# Altium project ELOC_Receiver.PrjPcb
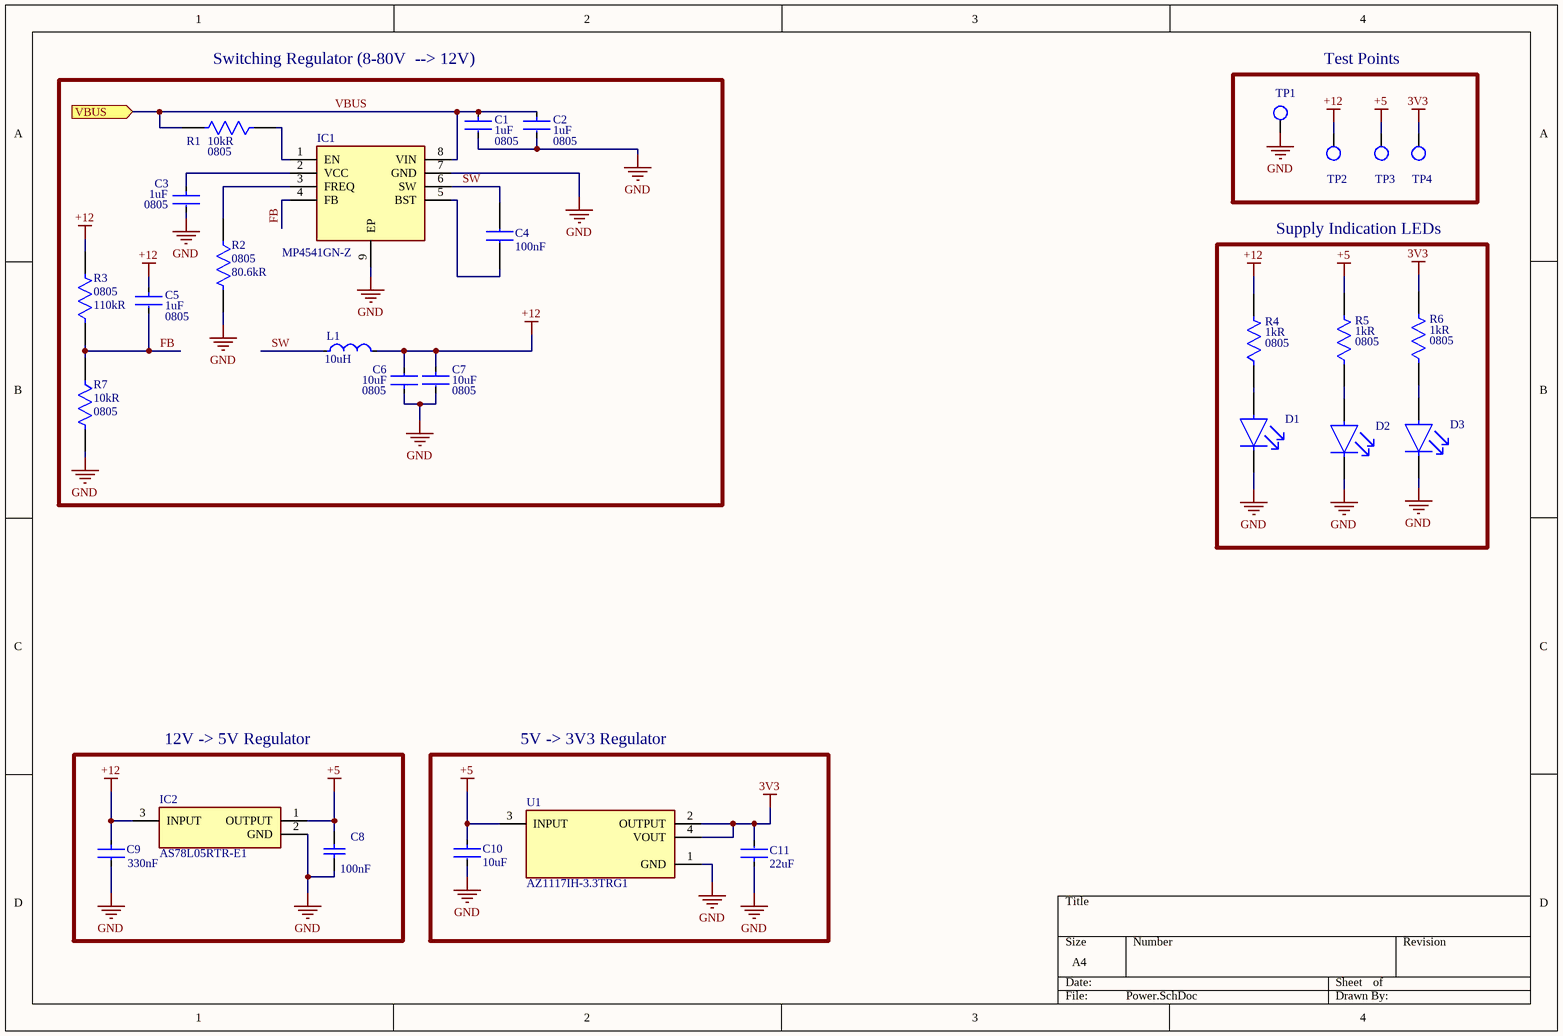
[diagram p0: Power.SchDoc]
3 sheets, 80 parts. Net scope: flat (ports and power ports of the same name join across sheets).
Board file: ELOC_Receiver.PcbDoc
Sheets:
  Power.SchDoc
  Rectifier.SchDoc
  Processor.SchDoc

## Sheet Power.SchDoc
size A4; SheetNumber: 1; SheetTotal: 3

### Parts
C1  Capacitance: 1uF  Case Code (Imperial): 0805  [FP-885012207078-MFG]  (hidden comment: 885012207078)
C2  Capacitance: 1uF  Case Code (Imperial): 0805  [FP-885012207078-MFG]  (hidden comment: 885012207078)
C3  Capacitance: 1uF  Case Code (Imperial): 0805  [FP-885012207078-MFG]  (hidden comment: 885012207078)
C4  Capacitance: 100nF  [C0805]  (hidden comment: C0805C104K1RACAUTO7210)
C5  Capacitance: 1uF  Case Code (Imperial): 0805  [FP-885012207078-MFG]  (hidden comment: 885012207078)
C6  Capacitance: 10uF  Case/Package: 0805  [FP-CL21-IPC_C]  (hidden comment: CL21A106KOQNNNG)
C7  Capacitance: 10uF  Case/Package: 0805  [FP-CL21-IPC_C]  (hidden comment: CL21A106KOQNNNG)
C8  Capacitance: 100nF  [CAPC2013X140X50ML20T25]  (hidden comment: 08055D104KAT2A)
C9  Capacitance: 330nF  [FP-CL21-F-IPC_C]  (hidden comment: CL21B334KBFNNNE)
C10  Capacitance: 10uF  [FP-CL21-IPC_B]  (hidden comment: CL21A106KOQNNNE)
C11  Capacitance: 22uF  [FP-CL21-IPC_B]  (hidden comment: CL21A226MQQNNNG)
D1  12V  [FP-150060VS75000-MFG]  (value not drawn)
D2  5V  [FP-150060VS75000-MFG]  (value not drawn)
D3  3V3  [FP-150060VS75000-MFG]  (value not drawn)
IC1  MP4541GN-Z  [SOIC127P600X170-9N]
IC2  AS78L05RTR-E1  [DIODES_SOT-89]
L1  Inductance: 10uH  [FP-LB2518-1_8-0_2-IPC_A]  (hidden comment: LBR2518T100K)
R1  Resistance: 10kR  Case Code (Imperial): 0805  [FP-RMCF0805-IPC_A]  (hidden comment: RMCF0805JT10K0)
R2  Case/Package: 0805  Resistance: 80.6kR  [FP-CRCW0805-e3-IPC_A]  (hidden comment: CRCW080580K6FKEA)
R3  Size Code: 0805  Resistance: 110kR  [FP-RMCF0805-IPC_C]  (hidden comment: RMCF0805FT110K)
R4  Resistance: 1kR  Size Code: 0805  [FP-RNCP0805-MFG]  (hidden comment: RNCP0805FTD1K00)
R5  Resistance: 1kR  Size Code: 0805  [FP-RNCP0805-MFG]  (hidden comment: RNCP0805FTD1K00)
R6  Resistance: 1kR  Size Code: 0805  [FP-RNCP0805-MFG]  (hidden comment: RNCP0805FTD1K00)
R7  Resistance: 10kR  Case Code (Imperial): 0805  [FP-RMCF0805-IPC_A]  (hidden comment: RMCF0805JT10K0)
TP1  GND  [TESTPOINT_LOOP]  (value not drawn)
TP2  12V  [TESTPOINT_LOOP]  (value not drawn)
TP3  5V  [TESTPOINT_LOOP]  (value not drawn)
TP4  3V3  [TESTPOINT_LOOP]  (value not drawn)
U1  AZ1117IH-3.3TRG1  [FP-SOT223-IPC_B]

### Blocks framed on the sheet
Switching Regulator (8-80V  --> 12V): C1-C7 IC1 L1 R1-R3 R7
Test Points: TP1-TP4
Supply Indication LEDs: D1-D3 R4-R6
12V -> 5V Regulator: C8 C9 IC2
5V -> 3V3 Regulator: C10 C11 U1

### Ports
VBUS (in)

### Nets
3V3: C11.2 R6.2 TP4.1 U1.2(OUTPUT) U1.4(VOUT)
+5: C8.2 C10.1 IC2.1(OUTPUT) R5.2 TP3.1 U1.3(INPUT)
+12: C5.1 C6.2 C7.1 C9.1 IC2.3(INPUT) L1.2 R3.2 R4.2 TP2.1
GND: C1.2 C2.2 C3.2 C6.1 C7.2 C8.1 C9.2 C10.2 C11.1 D1.1(C) D2.1(C) D3.1(C) IC1.7(GND) IC1.9(EP) IC2.2(GND) R2.2 R7.2 TP1.1 U1.1(GND)
FB: C5.2 IC1.4(FB) R3.1 R7.1
SW: C4.2 IC1.6(SW) L1.1
VBUS: C1.1 C2.1 IC1.8(VIN) R1.2 ; port VBUS
NetC3_1: C3.1 IC1.2(VCC)
NetC4_1: C4.1 IC1.5(BST)
NetD1_2: D1.2(A) R4.1
NetD2_2: D2.2(A) R5.1
NetD3_2: D3.2(A) R6.1
NetIC1_1: IC1.1(EN) R1.1
NetIC1_3: IC1.3(FREQ) R2.1

### Library data of the parts
C1-C3 C5 = CMP-207839-000010-1: CAP CER 1UF 25V X7R 0805; Tolerance: 10%; Series: WCAP-CSGP; Mount: Surface Mount; RoHS Compliant: Yes; Case Code (Metric): 2012; Width: 0.049inch; Thickness: 0.053inch; Dielectric: X7R; Max Operating Temperature: 125°C; Case/Package: 0805; Length: 0.079inch; Voltage Rating: 25V; Packaging: Cut Tape; Min Operating Temperature: -55°C; Voltage Rating (DC): 25V
C4 = C0805C104K1RACAUTO7210: Capacitor; Manufacturer_Name: KEMET; Datasheet Link: https://content.kemet.com/datasheets/KEM_C1023_X7R_AUTO_SMD.pdf; Height: 1.1mm; Manufacturer_Part_Number: C0805C104K1RACAUTO7210; Mouser Part Number: 80-C0805C104K1RAUTLR; Mouser Price/Stock: https://www.mouser.co.uk/ProductDetail/KEMET/C0805C104K1RACAUTO7210?qs=NJR6qtu0rR34GE7CYHVK6Q%3D%3D; Arrow Part Number: C0805C104K1RACAUTO7210; Arrow Price/Stock: https://www.arrow.com/en/products/c0805c104k1racauto7210/kemet-corporation?region=europe
C6 C7 = CMP-13271-002240-1: CL21 Series 0805 10uF 16V ±10% Tolerance X5R Multilayer Ceramic Chip Capacitor; Case Code (Metric): 2012; Package Quantity: 3000; Width: 0.049inch; Mount: Surface Mount; Depth: 1.25mm; Material: Ceramic; Min Operating Temperature: -55°C; Thickness: 0.053inch; Tolerance: 10%; Case Code (Imperial): 0805; Packaging: Tape and Reel; Voltage Rating: 16V; Height: 1.25mm; Voltage: 16V; Max Operating Temperature: 85°C; Length: 2mm; Dielectric: X5R
C8 = CMP-2007-04689-1: Manufacturer: AVX Interconnect / Elco; Part Number: 08055D104KAT2A
C9 = CMP-13271-000003-1: CAP CER 0.33UF 50V X7R 0805; Manufacturer: Samsung Electro-Mechanics; Temperature Coefficient: 15%; Value: 330nF; Material: Ceramic; Tolerance: 10%; Category: Cap; Temperature Range Low: -55°C; Height: 1.35mm; Ipc Land Pattern Name: CAPC200125X125; ComponentLink2URL: http://www.samsungsem.com/kr/support/product-search/mlcc/__icsFiles/afieldfile/2018/07/24/CL21B334KBFNNNE.pdf; Octopart: https://octopart.com/cl21b334kbfnnne-samsung-9287149; Digikey Description: CAP CER 0.33UF 50V X7R 0805; Automotive: No; ComponentLink2Description: Datasheet; Lead Free: Yes; Voltage Rating: 50V; Device Class L2: Capacitors; Device Class L1: Passive Components; RoHS: TRUE; Manufacturer Part Number: CL21B334KBFNNNE; Temperature: -55°C to +125°C; Package: CL21-F; Temperature Range High: +125°C; Temperature Characteristic: X7R; Device Class L3: Ceramic Capacitors
C10 = CMP-2000-06102-2: CL21 Series 0805 10uF 16V ±10% Tolerance X5R Multilayer Ceramic Chip Capacitor; Dielectric: X7R; Length: 2mm; Depth: 1.25mm; Voltage: 16V; Width: 0.049inch; Lead Free: Lead Free; Max Operating Temperature: 85°C; Mount: Surface Mount; Voltage Rating: 16V; Height: 1.25mm; Radiation Hardening: No; Packaging: Tape and Reel; Voltage Rating (DC): 16V; Thickness: 0.055inch; Case/Package: 0805; Case Code (Imperial): 0805; Min Operating Temperature: -55°C; Case Code (Metric): 2012; Package Quantity: 1; Tolerance: 10%
C11 = CMP-13271-002967-1: CL21 Series 0805 22uF 6.3V ±20% Tolerance X5R Multilayer Ceramic Chip Capacitor; Tolerance: 20%; Case Code (Imperial): 0805; Package Quantity: 3000; Min Operating Temperature: -55°C; Case Code (Metric): 2012; Length: 2mm; Material: Ceramic; Max Operating Temperature: 85°C; Radiation Hardening: No; Packaging: Tape and Reel; Depth: 1.25mm; Mount: Surface Mount; Dielectric: X5R; Case/Package: 0805; Height: 1.25mm; Thickness: 0.055inch; Voltage: 6.3V; Width: 0.049inch; Voltage Rating: 6.3V
D1 D3 = CMP-1426-00006-5: LED GREEN CLEAR 0603 SMD; Viewing Angle: 140°; Reverse Voltage (DC): 5V; Forward Voltage: 2V; Power Rating: 72mW; Lens Size: 0.7mm; Test Current: 20mA; Lens Color: Colorless; Lens Style: Rectangular; Luminous Intensity: 40mcd; Wavelength: 570nm; Length: 1.6mm; Max Operating Temperature: 85°C; Lens Transparency: Clear; Width: 0.8mm; Mount: Surface Mount; Weight: 0.000882oz; Package Quantity: 4000; Packaging: Cut Tape; RoHS Compliant: Yes; Case/Package: 0603; Series: WL-SMCW; Case Code (Metric): 1608; Illumination Color: Green; Color: Green; Case Code (Imperial): 0603; Forward Current: 20mA; Min Operating Temperature: -40°C; Height: 0.8mm; Dominant Wavelength: 570nm; Number of Pins: 2
D2 = CMP-1426-00006-5: LED GREEN CLEAR 0603 SMD; Viewing Angle: 140°; Forward Voltage: 2V; Power Rating: 72mW; Lens Size: 0.7mm; Test Current: 20mA; Lens Color: Colorless; Lens Style: Rectangular; Luminous Intensity: 40mcd; Wavelength: 570nm; Length: 1.6mm; Max Operating Temperature: 85°C; Reverse Voltage (DC): 5V; Lens Transparency: Clear; Width: 0.8mm; Mount: Surface Mount; Weight: 0.000882oz; Package Quantity: 4000; Packaging: Cut Tape; RoHS Compliant: Yes; Case/Package: 0603; Series: WL-SMCW; Case Code (Metric): 1608; Illumination Color: Green; Color: Green; Case Code (Imperial): 0603; Forward Current: 20mA; Min Operating Temperature: -40°C; Height: 0.8mm; Dominant Wavelength: 570nm; Number of Pins: 2
IC1 = MP4541GN-Z: Integrated Circuit; Manufacturer_Name: Monolithic Power Systems (MPS); Datasheet Link: https://www.monolithicpower.com/en/documentview/productdocument/index/version/2/document_type/Datasheet/lang/en/sku/MP4541GN/; Height: 1.7mm; Manufacturer_Part_Number: MP4541GN-Z; Mouser Part Number: 946-MP4541GN-Z; Mouser Price/Stock: https://www.mouser.co.uk/ProductDetail/Monolithic-Power-Systems-MPS/MP4541GN-Z?qs=TCDPyi3sCW3JrMFxnpK4AA%3D%3D
IC2 = AS78L05RTR-E1: Integrated Circuit; Manufacturer_Name: Diodes Inc.; Datasheet Link: https://www.diodes.com/assets/Datasheets/AS78Lxx.pdf; Manufacturer_Part_Number: AS78L05RTR-E1; Mouser Part Number: 621-AS78L05RTR-E1; Mouser Price/Stock: https://www.mouser.co.uk/ProductDetail/Diodes-Incorporated/AS78L05RTR-E1?qs=FKu9oBikfSksfBIasZ7FtQ%3D%3D; Arrow Part Number: AS78L05RTR-E1; Arrow Price/Stock: https://www.arrow.com/en/products/as78l05rtr-e1/diodes-incorporated?region=asia
L1 = CMP-14484-000483-1: SMD Inductors 10uH ±10% 0.235A 0.247Ω 1007; Test Frequency: 2.52MHz; Core Material: Ferrite; Max DC Current: 235mA; Shielding: Unshielded; DC Resistance (DCR): 190mR; Self Resonant Frequency: 30MHz; Package Quantity: 2000; Height - Seated (Max): 0.079inch; Lead Free: Lead Free; Radiation Hardening: No; Case Code (Metric): 2518; Mount: Surface Mount; Current Rating: 235mA; Width: 0.071inch; Military Standard: Not; Tolerance: 10%; Series: LB; Case/Package: 1007; Termination: SMD/SMT; DC Current: 235mA; Height: 1.8mm; Inductance Tolerance: 10%; Max Operating Temperature: 105°C; Packaging: Tape and Reel; Case Code (Imperial): 1007; Min Operating Temperature: -40°C; Depth: 2mm; Resistor Type: Wirewound; RoHS Compliant: Yes; Halogen Free: Halogen Free; Length: 0.098inch; Lead Pitch: 1.5mm
R1 R7 = CMP-26527-002663-1: 10kΩ ±5% 0.125W 0805 Thick Film Chip Resistor AEC-Q200 compliant; Max Power Dissipation: 125mW; Temperature Coefficient: 100ppm/°C; Construction: Rectangular; RoHS Compliant: Yes; Resistor Type: Thick Film; Series: RMCF; Features: Automotive AEC-Q200; Mount: Surface Mount; Min Operating Temperature: -55°C; Military Standard: Not; Tolerance: 5%; Size Code: 0805; Contact Plating: Tin; Length: 2mm; Depth: 1.25mm; Case Code (Metric): 2012; Packaging: Tape and Reel; Radiation Hardening: No; Height: 0.026inch; Case/Package: 0805; Width: 0.049inch; Lead Free: Lead Free; Max Operating Temperature: 155°C; Number of Terminations: 2; Power Rating: 125mW
R2 = CMP-2001-04127-2: RES Thick Film, 80.6kΩ, 1%, 0.125W, 100ppm/°C, 0805; Power Rating: 125mW; Voltage Rating: 150V; Tolerance: 1%; Min Operating Temperature: -55°C; Number of Pins: 2; Max Power Dissipation: 125mW; Radiation Hardening: No; Max Operating Temperature: 155°C; Composition: Thick Film; Temperature Coefficient: 100ppm/°C; Width: 1.25mm; Length: 2mm; Case Code (Metric): 2012; Packaging: Tape and Reel; Contact Plating: Tin; Termination: Solder; Features: Automotive AEC-Q200; Number of Terminations: 2; Military Standard: Not; Weight: 0.000194oz; Case Code (Imperial): 0805; Depth: 1.25mm; Lead Free: Lead Free; Package Quantity: 10; Height: 0.45mm; Voltage Rating (DC): 150V
R3 = CMP-26527-000712-1: 110kΩ ±1% 0.125W 0805 Thick Film Chip Resistor AEC-Q200 compliant; Power Rating: 125mW; Temperature Coefficient: 100ppm/°C; Features: Automotive AEC-Q200; Radiation Hardening: No; Width: 0.049inch; RoHS Compliant: Yes; Length: 0.079inch; Max Power Dissipation: 125mW; Case Code (Imperial): 0805; Mount: Surface Mount; Series: RMCF; Max Operating Temperature: 155°C; Lead Free: Lead Free; Case Code (Metric): 2012; Height: 0.026inch; Case/Package: 0805; Number of Terminations: 2; Resistor Type: Thick Film; Packaging: Tape and Reel; Tolerance: 1%; Contact Plating: Tin; Min Operating Temperature: -55°C
R4-R6 = CMP-26527-001902-1: 1kΩ ±1% 0.25W 0805 High Power Anti-Sulfur Thin Film Chip Resistor; Power Rating: 250mW; Temperature Coefficient: 100ppm/°C; Series: RNCP; RoHS Compliant: Yes; Case Code (Metric): 2012; Length: 0.079inch; Case/Package: 0805; Max Power Dissipation: 250mW; Height: 0.024inch; Max Operating Temperature: 155°C; Tolerance: 1%; Min Operating Temperature: -55°C; Width: 0.049inch; Case Code (Imperial): 0805; Packaging: Tape and Reel; Mount: Surface Mount; Features: Moisture Resistant; Lead Free: Lead Free; Resistor Type: Thin Film; Number of Terminations: 2
TP1-TP4 = TESTPOINT_LOOP: PC TEST POINT MINIATURE WHITE; Manufacturer 1: Keystone Electronics; Manufacturer Part Number 1: 5002; Supplier Part Number 1: 36-5002-ND; Supplier 1: Digi-Key; Mount: Through Hole
U1 = CMP-12756-000043-1: IC REG LINEAR 3.3V 1A SOT223; Output Current: 800mA; Number of Regulators: 1; Dropout Voltage: 1.2V; RoHS Compliant: Yes; Min Current Limit: 1A; Mount: Surface Mount; Packaging: Tape and Reel; Output Voltage: 3.3V; Min Operating Temperature: -40°C; Max Operating Temperature: 125°C; Number of Pins: 3; Case/Package: TO-261-4

## Sheet Rectifier.SchDoc
size A4; SheetNumber: 2; SheetTotal: 3
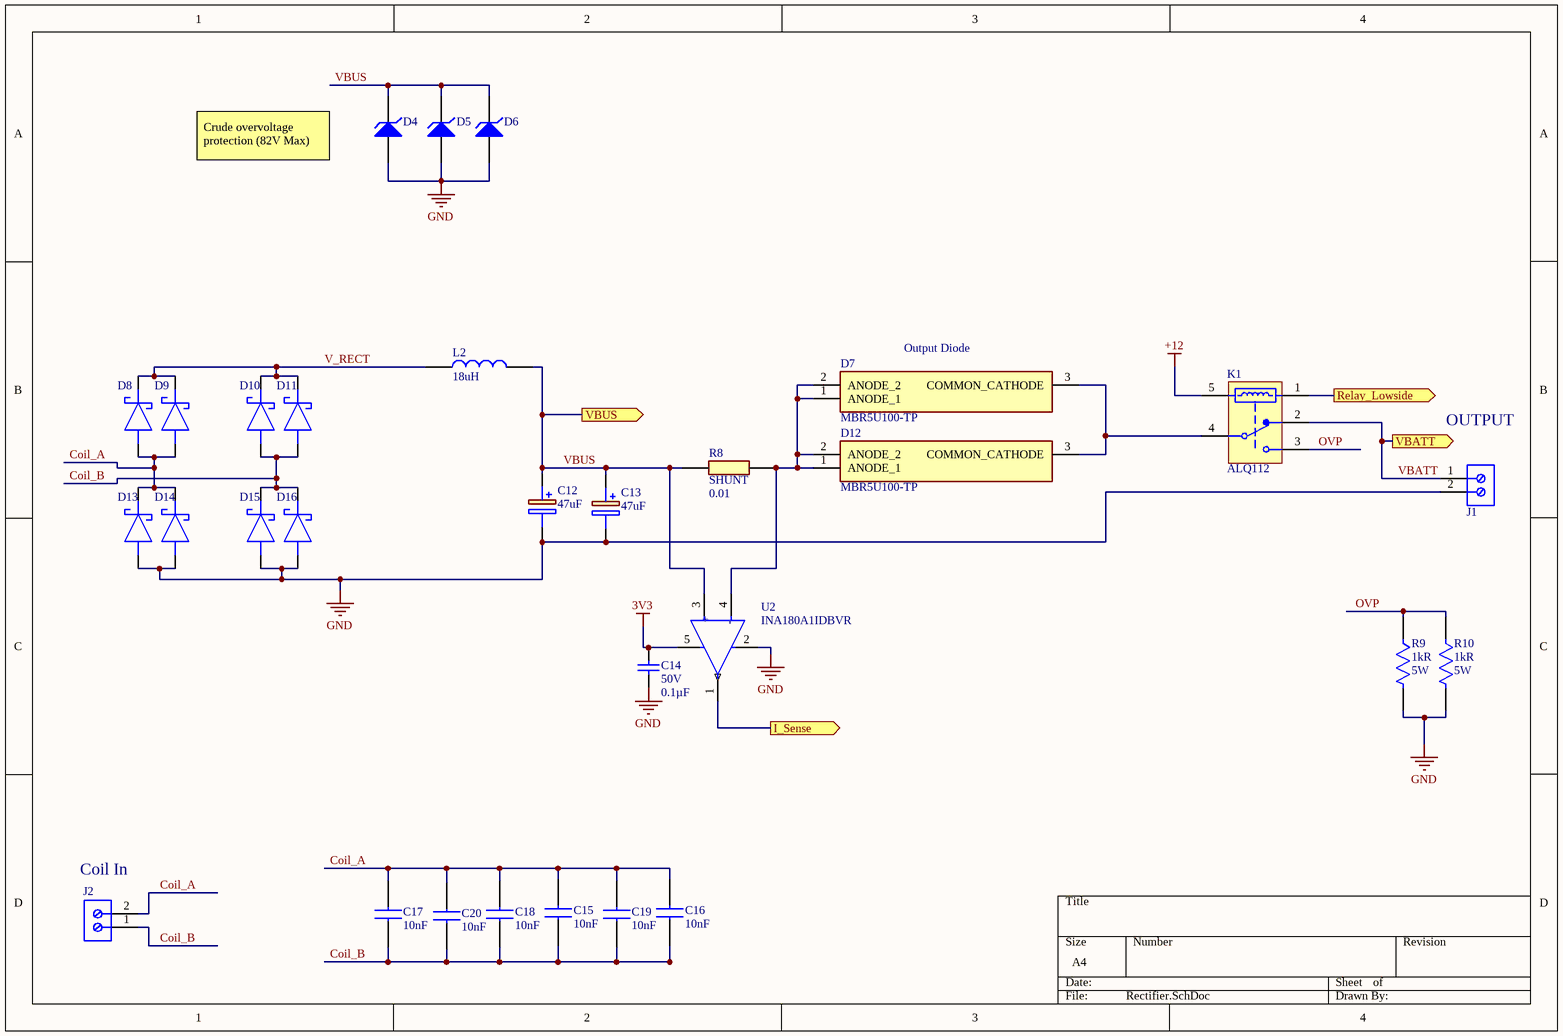
[diagram p1: Rectifier.SchDoc]

### Parts
C12  Capacitance: 47uF  [CAPAE1030X1080N]  (hidden comment: UCD1K470MNL1GS)
C13  Capacitance: 47uF  [CAPAE1030X1080N]  (hidden comment: UCD1K470MNL1GS)
C14  Voltage - Rated: 50V  Capacitance: 0.1µF  [CAP0805]  (hidden comment: C0805C104K5RACTU)
C15  Capacitance: 10nF  [CAPC3216X110N]  (hidden comment: C1206C103JAGECAUTO)
C16  Capacitance: 10nF  [CAPC3216X110N]  (hidden comment: C1206C103JAGECAUTO)
C17  Capacitance: 10nF  [CAPC3216X110N]  (hidden comment: C1206C103JAGECAUTO)
C18  Capacitance: 10nF  [CAPC3216X110N]  (hidden comment: C1206C103JAGECAUTO)
C19  Capacitance: 10nF  [CAPC3216X110N]  (hidden comment: C1206C103JAGECAUTO)
C20  Capacitance: 10nF  [CAPC3216X110N]  (hidden comment: C1206C103JAGECAUTO)
D4  1SMB5947BT3G  [ONSC-SMB-2-403A-03_H_V]  (value not drawn)
D5  1SMB5947BT3G  [ONSC-SMB-2-403A-03_H_V]  (value not drawn)
D6  1SMB5947BT3G  [ONSC-SMB-2-403A-03_H_V]  (value not drawn)
D7  MBR5U100-TP  [MBR5U100TP]
D8  STPS4S200UFN  [SODFL5436X110N]  (value not drawn)
D9  STPS4S200UFN  [SODFL5436X110N]  (value not drawn)
D10  STPS4S200UFN  [SODFL5436X110N]  (value not drawn)
D11  STPS4S200UFN  [SODFL5436X110N]  (value not drawn)
D12  MBR5U100-TP  [MBR5U100TP]
D13  STPS4S200UFN  [SODFL5436X110N]  (value not drawn)
D14  STPS4S200UFN  [SODFL5436X110N]  (value not drawn)
D15  STPS4S200UFN  [SODFL5436X110N]  (value not drawn)
D16  STPS4S200UFN  [SODFL5436X110N]  (value not drawn)
J1  691137710002  [691137710002]  (value not drawn)
J2  691137710002  [691137710002]  (value not drawn)
K1  ALQ112  [PNSC-LQ-5-2000x1000x1600_V]
L2  Inductance: 18uH  [SDR1307-220ML]  (hidden comment: SDR1307-180ML)
R8  SHUNT  Resistance: 0.01  [RESC6434X90N]
R9  Resistance: 1kR  Max Power Dissipation: 5W  [FP-SMF5-MFG]  (hidden comment: SMF51K0JT)
R10  Resistance: 1kR  Max Power Dissipation: 5W  [FP-SMF5-MFG]  (hidden comment: SMF51K0JT)
U2  INA180A1IDBVR  [FP-DBV0005A-IPC_A]

### Ports
I_Sense (out), Relay_Lowside (out), VBATT (out), VBUS (out)

### Nets
3V3: C14.2 U2.5(VS)
+12: K1.5
GND: C12.2(-) C13.2(-) C14.1 D4.2(A) D5.2(A) D6.2(A) D13.2(A) D14.2(A) D15.2(A) D16.2(A) J1.2 R9.2 R10.2 U2.2(GND)
Coil_A: C15.1 C16.1 C17.1 C18.1 C19.1 C20.1 D8.2(A) D9.2(A) D13.1(K) D14.1(K) J2.2
Coil_B: C15.2 C16.2 C17.2 C18.2 C19.2 C20.2 D10.2(A) D11.2(A) D15.1(K) D16.1(K) J2.1
OVP: K1.3(NO) R9.1 R10.1
V_RECT: D8.1(K) D9.1(K) D10.1(K) D11.1(K) L2.1
VBATT: J1.1 K1.2(NC) ; port VBATT
VBUS: C12.1(+) C13.1(+) D4.1(K) D5.1(K) D6.1(K) L2.2 R8.1 U2.3(IN+) ; port VBUS
NetD7_1: D7.1(ANODE_1) D7.2(ANODE_2) D12.1(ANODE_1) D12.2(ANODE_2) R8.2 U2.4(IN-)
NetD7_3: D7.3(COMMON_CATHODE) D12.3(COMMON_CATHODE) K1.4(COM)
NetK1_1: K1.1 ; port Relay_Lowside
NetU2_1: U2.1(OUT) ; port I_Sense

### Notes on the sheet
- Crude overvoltage protection (82V Max)
- (near D7) Output Diode
- (near J1) OUTPUT
- (near J2) Coil In
- (in symbol CMP-04895-000140-1) +; -

### Library data of the parts
C12 C13 = UCD1K470MNL1GS: Capacitor Polarised; Manufacturer_Name: Nichicon; Datasheet Link: https://www.arrow.com/en/products/ucd1k470mnl1gs/nichicon; Height: 10.8mm; Manufacturer_Part_Number: UCD1K470MNL1GS; Mouser Part Number: 647-UCD1K470MNL1GS; Mouser Price/Stock: https://www.mouser.co.uk/ProductDetail/Nichicon/UCD1K470MNL1GS?qs=c0uEScvPYN07T8BStUenxw%3D%3D; Arrow Part Number: UCD1K470MNL1GS; Arrow Price/Stock: https://www.arrow.com/en/products/ucd1k470mnl1gs/nichicon
C14 = C0805C104K5RACTU: CAP CER 0.1UF 50V X7R 0805; Tolerance: ±10%; Supplier 1: Digi-Key; Supplier Part Number 1: 399-1170-1-ND; Temperature Coefficient: X7R; Package / Case: 0805
C15-C20 = C1206C103JAGECAUTO: Capacitor; Manufacturer_Name: KEMET; Datasheet Link: https://content.kemet.com/datasheets/KEM_C1091_C0G_ESD.pdf; Height: 1.1mm; Manufacturer_Part_Number: C1206C103JAGECAUTO; Mouser Part Number: 80-C1206C103JAGECAUT; Mouser Price/Stock: https://www.mouser.co.uk/ProductDetail/KEMET/C1206C103JAGECAUTO?qs=MLItCLRbWsxJM3Q8yxQv7A%3D%3D; Arrow Part Number: C1206C103JAGECAUTO; Arrow Price/Stock: https://www.arrow.com/en/products/c1206c103jagecauto/kemet-corporation?region=nac
D4-D6 = CMP-1060-00168-1: 3 W Zener Voltage Regulator, 2-Pin SMB, Pb-Free, Tape and Reel; Manufacturer: On Semiconductor; VZ Typ (V): 82; Mounting Technology: Surface Mount; ComponentLink1URL: http://www.onsemi.com/; ComponentLink2Description: Datasheet; PackageDescription: 2-Pin Small Molded Package, J-Bend Lead, Body 4.33 x 3.625 mm; ComponentLink3URL: http://www.onsemi.com/pub_link/Collateral/1SMB5913BT3-D.PDF; DatasheetVersion: Rev. 8; ComponentLink2URL: http://www.onsemi.com/pub_link/Collateral/1SMB5913BT3-D.PDF; PackageReference: SMB-2-403A-03_H; PartNumber: 1SMB5947BT3G; RoHS: Pb-Free; PackageVersion: Rev. H, 05/2011; ComponentLink3Description: Package Specification; ComponentLink1Description: Manufacturer URL; Packing: Tape and Reel
D7 D12 = MBR5U100-TP: Schottky Diode; Manufacturer_Name: Micro Commercial Components (MCC); Datasheet Link: https://www.mccsemi.com/pdf/Products/MBR5U100(TO-277).pdf; Height: 1.2mm; Manufacturer_Part_Number: MBR5U100-TP
D8-D11 D13-D16 = STPS4S200UFN: Schottky Diode; Manufacturer_Name: STMicroelectronics; Datasheet Link: https://www.st.com/resource/en/datasheet/stps4s200.pdf; Height: 1.1mm; Manufacturer_Part_Number: STPS4S200UFN; Mouser Part Number: 511-STPS4S200UFN; Mouser Price/Stock: https://www.mouser.co.uk/ProductDetail/STMicroelectronics/STPS4S200UFN?qs=xZ%2FP%252Ba9zWqZ%2F%2FCgto3MYYA%3D%3D; Arrow Part Number: STPS4S200UFN; Arrow Price/Stock: https://www.arrow.com/en/products/stps4s200ufn/stmicroelectronics?region=europe
J1 J2 = CMP-1502-03324-1: Series 1377 - 5.00 mm Horizontal Entry with Pressure Clamp WR-TBL, 2 pin; Manufacturer: Wurth Elektronik; Pin Number: 2; Pitch: 5.00mm; Operating Temperature: -30to120degC; Package Reference: 691137710002; Publisher: WurthElektronik; Mounting Technology: THT; Manufacturer URL: http://www.we-online.de; Packaging: Box; Part Number: 691137710002; Datasheet URL: http://katalog.we-online.de/pbs/datasheet/691137710002.pdf
K1 = CMP-1503-00193-1: LQ Relays, 12 V Coil Voltage, 400 mW Nominal Operating Power, -40 to 85 degC, 5-Pin LQ, Carton, Case, RoHS; Manufacturer: Panasonic; Pb-Free: True; Max Switching Current: 10 A (N.O.), 3 A (N.C.); Electrical Life: 5x10^4; Coil Voltage: 12 V; Max Switching Voltage: 250 V AC; Nominal Operating Power: 400 mW; Mechanical Life(Min.operation): 1x10^7; Packing: Carton, Case; ComponentLink3URL: http://www3.panasonic.biz/ac/e_download/control/relay/power/catalog/mech_eng_lq.pdf?f_cd=401220; ComponentLink1URL: http://www3.panasonic.biz/ac/ae/index.jsp; ComponentLink1Description: Manufacturer URL; Series: LQ Relays; RoHS: True; PackageReference: LQ-5-2000x1000x1600; DatasheetVersion: 201410-T; ComponentLink2Description: Datasheet; ComponentLink2URL: http://www3.panasonic.biz/ac/e_download/control/relay/power/catalog/mech_eng_lq.pdf?f_cd=401220; PackageDescription: 5-Pin Through Hole Terminal Package, Body 20 x 10 mm; PackageVersion: ASCTB92E, 10/2014; PartNumber: ALQ112; ComponentLink3Description: Package Specification; Mounting Technology: Through Hole
L2 = SDR1307-180ML: Inductor; Manufacturer_Name: Bourns; Datasheet Link: https://www.bourns.com/docs/Product-Datasheets/SDR1307.pdf; Manufacturer_Part_Number: SDR1307-180ML; Mouser Part Number: 652-SDR1307-180ML; Mouser Price/Stock: https://www.mouser.co.uk/ProductDetail/Bourns/SDR1307-180ML?qs=meVWcSOgEr47xBfFHZvpmA%3D%3D; Arrow Part Number: SDR1307-180ML; Arrow Price/Stock: https://www.arrow.com/en/products/sdr1307-180ml/bourns?region=nac
R8 = CRA2512-FZ-R010ELF: Resistor; Manufacturer_Name: Bourns; Datasheet Link: http://www.bourns.com/PDFs/CRA.pdf; Height: 0.9mm; Manufacturer_Part_Number: CRA2512-FZ-R010ELF; Mouser Part Number: 652-CRA2512FZR010ELF; Mouser Price/Stock: https://www.mouser.co.uk/ProductDetail/Bourns/CRA2512-FZ-R010ELF?qs=WqWCsLCZBkoNPiv%2FXVnYvw%3D%3D; Arrow Part Number: CRA2512-FZ-R010ELF; Arrow Price/Stock: https://www.arrow.com/en/products/cra2512-fz-r010elf/bourns
R9 R10 = CMP-03211-011405-1: RES SMD 1K OHM 5% 5W 5329; Voltage Rating: 500V; Number of Resistors: 1; Temperature Coefficient: 100ppm/°C; Number of Terminations: 2; Depth: 7.3mm; Packaging: Tape and Reel; Case/Package: SMD/SMT; Tolerance: 5%; RoHS Compliant: Yes; Resistor Type: Power resistor; Features: Flame Retardant Coating; Max Operating Temperature: 280°C; Min Operating Temperature: -80°C; Mount: Surface Mount; Series: SM; Resistance Tolerance: 5%; Height: 6.8mm; Width: 7.3mm; Technology: METAL FILM; Power Rating: 5W; Case Code (Imperial): 5328; ELV: Compliant; Radiation Hardening: No; Voltage Rating (DC): 500V; Length: 13.5mm; Termination: Solder
U2 = CMP-04895-000140-1: IC CURR SENSE 1 CIRCUIT SOT23-5; Input Bias Current: 100nA; Input Offset Voltage (Vos): 100uV; Number of Circuits: 1; Slew Rate: 2V/µs; -3db Bandwidth: 350kHz; Operating Supply Current: 260uA; Case/Package: SOT-23-5; Min Operating Temperature: -40°C; Mount: Surface Mount; Packaging: Tape and Reel; Max Operating Temperature: 125°C

## Sheet Processor.SchDoc
size A4; SheetNumber: 3; SheetTotal: 3
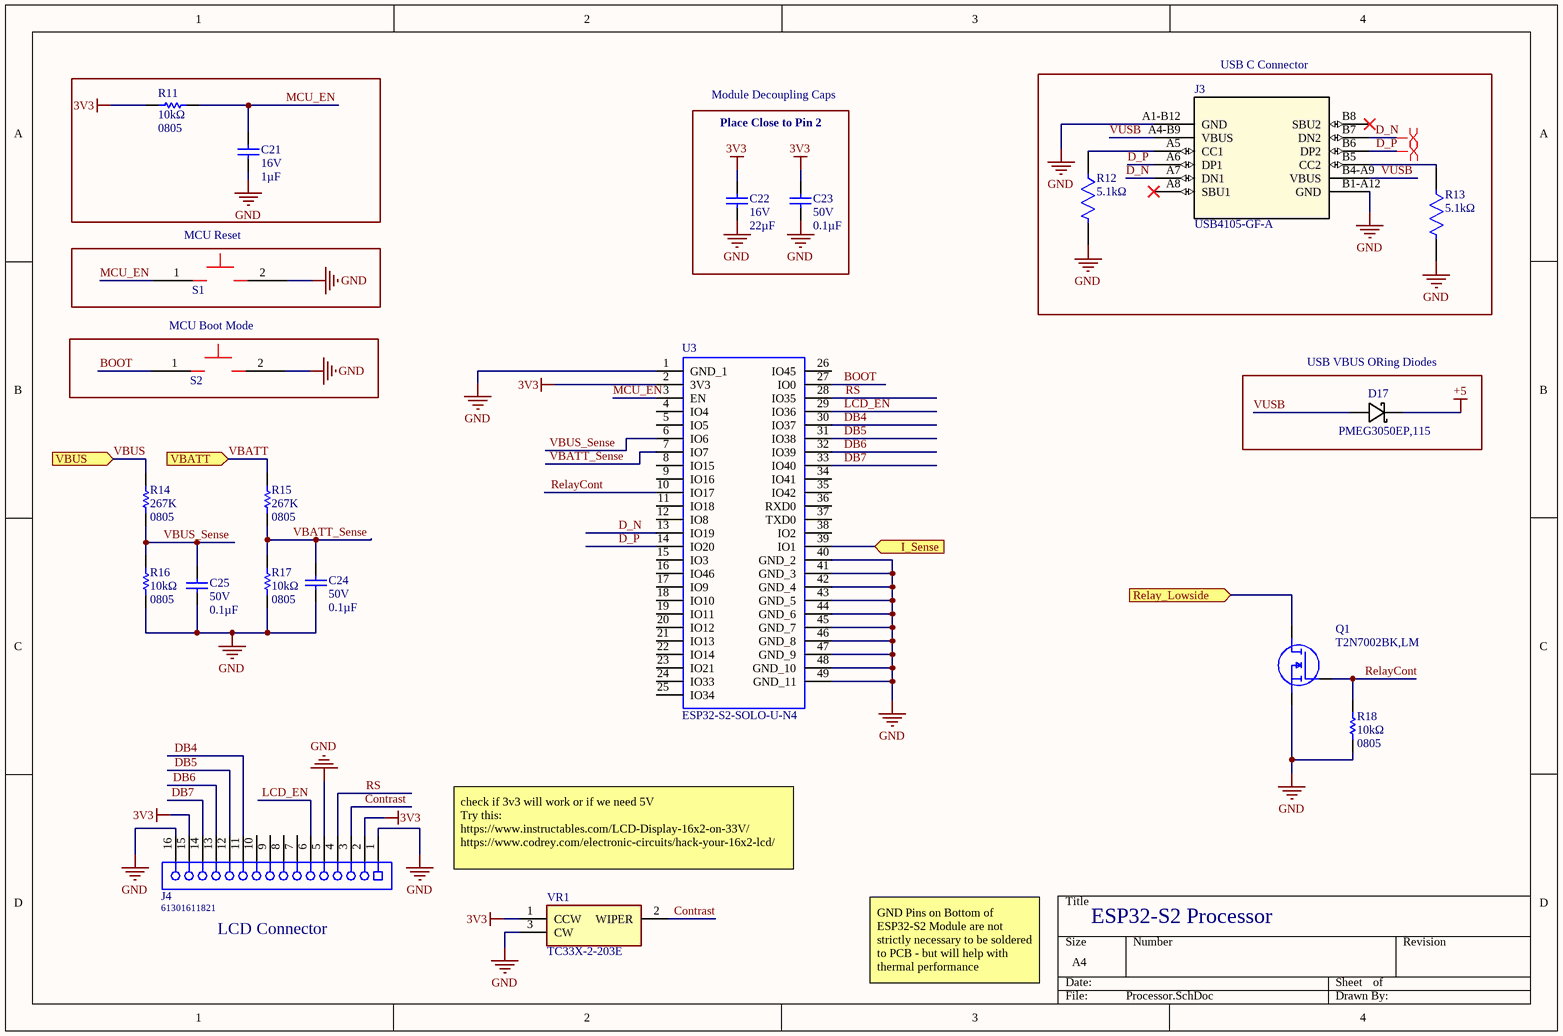
[diagram p2: Processor.SchDoc]

### Parts
C21  Voltage - Rated: 16V  Capacitance: 1µF  [CAP0805]  (hidden comment: GRM21BR71C105KA01L)
C22  Voltage - Rated: 16V  Capacitance: 22µF  [CAP0805]  (hidden comment: CL21A226MOCLRNC)
C23  Voltage - Rated: 50V  Capacitance: 0.1µF  [CAP0805]  (hidden comment: C0805C104K5RACTU)
C24  Voltage - Rated: 50V  Capacitance: 0.1µF  [CAP0805]  (hidden comment: C0805C104K5RACTU)
C25  Voltage - Rated: 50V  Capacitance: 0.1µF  [CAP0805]  (hidden comment: C0805C104K5RACTU)
D17  MFG_PN: PMEG3050EP,115  [SOD-128]  (hidden comment: D_PMEG3050EP,115)
J3  USB4105-GF-A  [USB4105_GCT]
J4  61301611821  [61301611821]
Q1  T2N7002BK,LM  [TBAT54CLM]
R11  Resistance: 10kΩ  Package / Case: 0805  [RES0805]  (hidden comment: RC0805FR-0710KL)
R12  Resistance: 5.1kΩ  [FP-CRCW0805-e3-MFG]  (hidden comment: CRCW08055K10FKEA)
R13  Resistance: 5.1kΩ  [FP-CRCW0805-e3-MFG]  (hidden comment: CRCW08055K10FKEA)
R14  Resistance: 267K  Package: 0805  [RESC2013X60X35NL10T20]  (hidden comment: RC0805FR-07267KL)
R15  Resistance: 267K  Package: 0805  [RESC2013X60X35NL10T20]  (hidden comment: RC0805FR-07267KL)
R16  Resistance: 10kΩ  Package / Case: 0805  [RES0805]  (hidden comment: RC0805FR-0710KL)
R17  Resistance: 10kΩ  Package / Case: 0805  [RES0805]  (hidden comment: RC0805FR-0710KL)
R18  Resistance: 10kΩ  Package / Case: 0805  [RES0805]  (hidden comment: RC0805FR-0710KL)
S1  RESET  [Tactile_Button_3X6X2]  (value not drawn)
S2  BOOT  [Tactile_Button_3X6X2]  (value not drawn)
U3  ESP32-S2-SOLO-U-N4  [ESP32S2SOLOUN4]
VR1  TC33X-2-203E  [TC33X2503E]

### Blocks framed on the sheet
USB C Connector: J3 R12 R13
MCU Reset: S1
MCU Boot Mode: S2
USB VBUS ORing Diodes: D17

### Ports
I_Sense (in), Relay_Lowside (in), VBATT (in), VBUS (in)

### Nets
3V3: C22.2 C23.2 J4.2 J4.15 R11.2 U3.2(3V3) VR1.1(CCW)
+5: D17.2
GND: C21.1 C22.1 C23.1 C24.1 C25.1 J3.A1-B12(GND) J3.B1-A12(GND) J4.1 J4.5 J4.16 Q1.2(S) R12.2 R13.2 R16.2 R17.1 R18.1 S1.2 S2.2 U3.1(GND_1) U3.40(GND_2) U3.41(GND_3) U3.42(GND_4) U3.43(GND_5) U3.44(GND_6) U3.45(GND_7) U3.46(GND_8) U3.47(GND_9) U3.48(GND_10) U3.49(GND_11) VR1.3(CW)
BOOT: S2.1 U3.27(IO0)
Contrast: J4.3 VR1.2(WIPER)
D_N: J3.A7(DN1) J3.B7(DN2) U3.13(IO19)
D_P: J3.A6(DP1) J3.B6(DP2) U3.14(IO20)
DB4: J4.11 U3.30(IO37)
DB5: J4.12 U3.31(IO38)
DB6: J4.13 U3.32(IO39)
DB7: J4.14 U3.33(IO40)
LCD_EN: J4.6 U3.29(IO36)
MCU_EN: C21.2 R11.1 S1.1 U3.3(EN)
RelayCont: Q1.1(G) R18.2 U3.10(IO17)
RS: J4.4 U3.28(IO35)
VBATT: R15.2 ; port VBATT
VBATT_Sense: C24.2 R15.1 R17.2 U3.7(IO7)
VBUS: R14.2 ; port VBUS
VBUS_Sense: C25.2 R14.1 R16.1 U3.6(IO6)
VUSB: D17.1 J3.A4-B9(VBUS) J3.B4-A9(VBUS)
NetJ3_A5: J3.A5(CC1) R12.1
NetJ3_B5: J3.B5(CC2) R13.1
NetK1_1: Q1.3(D) ; port Relay_Lowside
NetU2_1: U3.39(IO1) ; port I_Sense

Not connected (* = marked no-connect by the designer): J3 A8(SBU1)* B8(SBU2)*; J4 7 8 9 10; U3 4(IO4) 5(IO5) 8(IO15) 9(IO16) 11(IO18) 12(IO8) 15(IO3) 16(IO46) 17(IO9) 18(IO10) 19(IO11) 20(IO12) 21(IO13) 22(IO14) 23(IO21) 24(IO33) 25(IO34) 26(IO45) 34(IO41) 35(IO42) 36(RXD0) 37(TXD0) 38(IO2)

### Layout directives
differential pair: D_N, D_P

### Notes on the sheet
- Module Decoupling Caps
- Place Close to Pin 2
- check if 3v3 will work or if we need 5V
  Try this:
  https://www.instructables.com/LCD-Display-16x2-on-33V/
  https://www.codrey.com/electronic-circuits/hack-your-16x2-lcd/
- ESP32-S2 Processor
- LCD Connector
- GND Pins on Bottom of ESP32-S2 Module are not strictly necessary to be soldered to PCB - but will help with thermal performance

### Library data of the parts
C21 = GRM21BR71C105KA01L: CAP CER 1UF 16V X7R 0805; Manufacturer: Murata Electronics North America; Tolerance: ±10%; Temperature Coefficient: X7R; Operating Temperature: -55°C ~ 125°C; Supplier 1: Digi-Key; Supplier Part Number 1: 490-1691-1-ND; Package / Case: 0805
C22 = CL21A226MOCLRNC: CAP CER 22UF 16V X5R 0805; Tolerance: ±20%; Supplier 1: Digi-Key; Supplier Part Number 1: 1276-6780-1-ND; Temperature Coefficient: X5R; Footprint: 0805
C23-C25 = C0805C104K5RACTU: as C14 on sheet Rectifier; Supplier 1: Digi-Key; Supplier Part Number 1: 399-1170-1-ND; Temperature Coefficient: X7R; Package / Case: 0805
D17 = D_PMEG3050EP,115: DIODE SCHOTTKY 360mV 30V 5A; MFG: Nexperia; Supplier: Digikey; Supplier_PN: 1727-5317-1-ND
J3 = USB4105-GF-A: No Description Available; Mfr_Name: Global Connector Technology; Copyright: Copyright (C) 2022 Ultra Librarian. All rights reserved.; Manufacturer_Part_Number: USB4105-GF-A; Digi-Key_Part_Number_1: 2073-USB4105-GF-ACT-ND; Digi-Key_Part_Number_2: 2073-USB4105-GF-ADKR-ND; Digi-Key_Part_Number_3: 2073-USB4105-GF-ATR-ND; RefDes: RefDes; Type: DEV
J4 = CMP-1502-01343-1: THT Vertical Socket Header WR-PHD, Pitch 2.54 mm, Single Row, 16 pins; Manufacturer: Wurth Elektronik; Working Voltage: 250VAC; Pin Number: 16; Gender: Female; Withstanding Voltage: 500VAC; Rated Current: 3A; Contact Resistance: 20mOhm; Pitch: 2.54mm; Operating Temperature: -40to125degC; Manufacturer URL: http://www.we-online.de; Mounting Technology: THT; Part Number: 61301611821; Datasheet URL: https://katalog.we-online.de/em/datasheet/6130xx11821.pdf; Publisher: WurthElektronik; Row Number: Single; Orientation: Vertical; Packaging: Tray; Package Reference: 61301611821
Q1 = T2N7002BK,LM: MOSFET (N-Channel); Manufacturer_Name: Toshiba; Datasheet Link: https://toshiba.semicon-storage.com/info/docget.jsp?did=30376&prodName=T2N7002BK; Height: 1.1mm; Manufacturer_Part_Number: T2N7002BK,LM; Mouser Part Number: 757-T2N7002BKLM; Mouser Price/Stock: https://www.mouser.co.uk/ProductDetail/Toshiba/T2N7002BKLM?qs=lX6dEUlT%252BgfTnU11z%2FTylg%3D%3D; Arrow Part Number: T2N7002BK,LM; Arrow Price/Stock: https://www.arrow.com/en/products/t2n7002bklm/toshiba?region=nac
R11 R16-R18 = RC0805FR-0710KL: RES SMD 10K OHM 1% 1/8W 0805; Manufacturer: Yageo; Power (Watts): 0.125W, 1/8W; Temperature Coefficient: ±100ppm/°C; Supplier 1: Digi-Key; Supplier Part Number 1: 311-10.0KCRCT-ND; Tolerance: ±1%; Composition: Thick Film; Features: Moisture Resistant; Operating Temperature: -55°C ~ 155°C
R12 R13 = CMP-2001-04024-2: RES Thick Film, 5.1kΩ, 1%, 0.125W, 100ppm/°C, 0805; Power Rating: 125mW; Voltage Rating (DC): 150V; Packaging: Tape and Reel; Case Code (Metric): 2012; Contact Plating: Tin; Case Code (Imperial): 0805; Depth: 1.25mm; Tolerance: 1%; Width: 0.049inch; Temperature Coefficient: 100ppm/°C; Max Power Dissipation: 125mW; Military Standard: Not; Lead Free: Lead Free; Mount: Surface Mount; Min Operating Temperature: -55°C; Package Quantity: 10; Weight: 0.000194oz; Height: 0.45mm; Number of Terminations: 2; Max Operating Temperature: 155°C; Termination: SMD/SMT; Case/Package: 0805; Composition: Thick Film; Voltage Rating: 150V; Length: 2mm; Features: Automotive AEC-Q200; Radiation Hardening: No
R14 R15 = CMP-2001-01033-1: Manufacturer: Yageo; Part Number: RC0805FR-07267KL
S1 S2 = Tactile Button_3X6X2
U3 = ESP32-S2-SOLO-U-N4: WiFi Modules - 802.11 SMD module, ESP32-S2, 4 MB SPI flash, IPEX antenna; Manufacturer_Name: Espressif Systems; Geometry.Height: 3.35mm; Mouser Part Number: 356-ESP32-S2-SOLOUN4; Mouser Price/Stock: https://www.mouser.co.uk/ProductDetail/Espressif-Systems/ESP32-S2-SOLO-U-N4?qs=pBJMDPsKWf24meOzbFo%252B2g%3D%3D; Manufacturer_Part_Number: ESP32-S2-SOLO-U-N4; Datasheet Link: https://www.espressif.com/sites/default/files/documentation/esp32-s2-solo_esp32-s2-solo-u_datasheet_en.pdf
VR1 = TC33X-2-203E: Variable Resistor; Manufacturer_Name: Bourns; Datasheet Link: https://www.bourns.com/pdfs/TC33.pdf; Height: 1.2mm; Manufacturer_Part_Number: TC33X-2-203E; Mouser Part Number: 652-TC33X-2-203E; Mouser Price/Stock: https://www.mouser.co.uk/ProductDetail/Bourns/TC33X-2-203E?qs=kSSonJSvPGoOcNyKSIM%252Bog%3D%3D; Arrow Part Number: TC33X-2-203E; Arrow Price/Stock: https://www.arrow.com/en/products/tc33x-2-203e/bourns?region=nac

## Nets that join several sheets
3V3: Power (5 pins), Rectifier (C14.2 U2.5), Processor (7 pins)
+5: Power (6 pins), Processor (D17.2)
+12: Power (9 pins), Rectifier (K1.5)
GND: Power (19 pins), Rectifier (14 pins), Processor (30 pins)
NetK1_1: Rectifier (K1.1), Processor (Q1.3)
NetU2_1: Rectifier (U2.1), Processor (U3.39)
VBATT: Rectifier (J1.1 K1.2), Processor (R15.2)
VBUS: Power (C1.1 C2.1 IC1.8 R1.2), Rectifier (8 pins), Processor (R14.2)